# Altium schematic sheet GPIO_EXPANDER_Sheet.SchDoc
size 420 x 297 mm; SheetNumber: 6; SheetTotal: 14
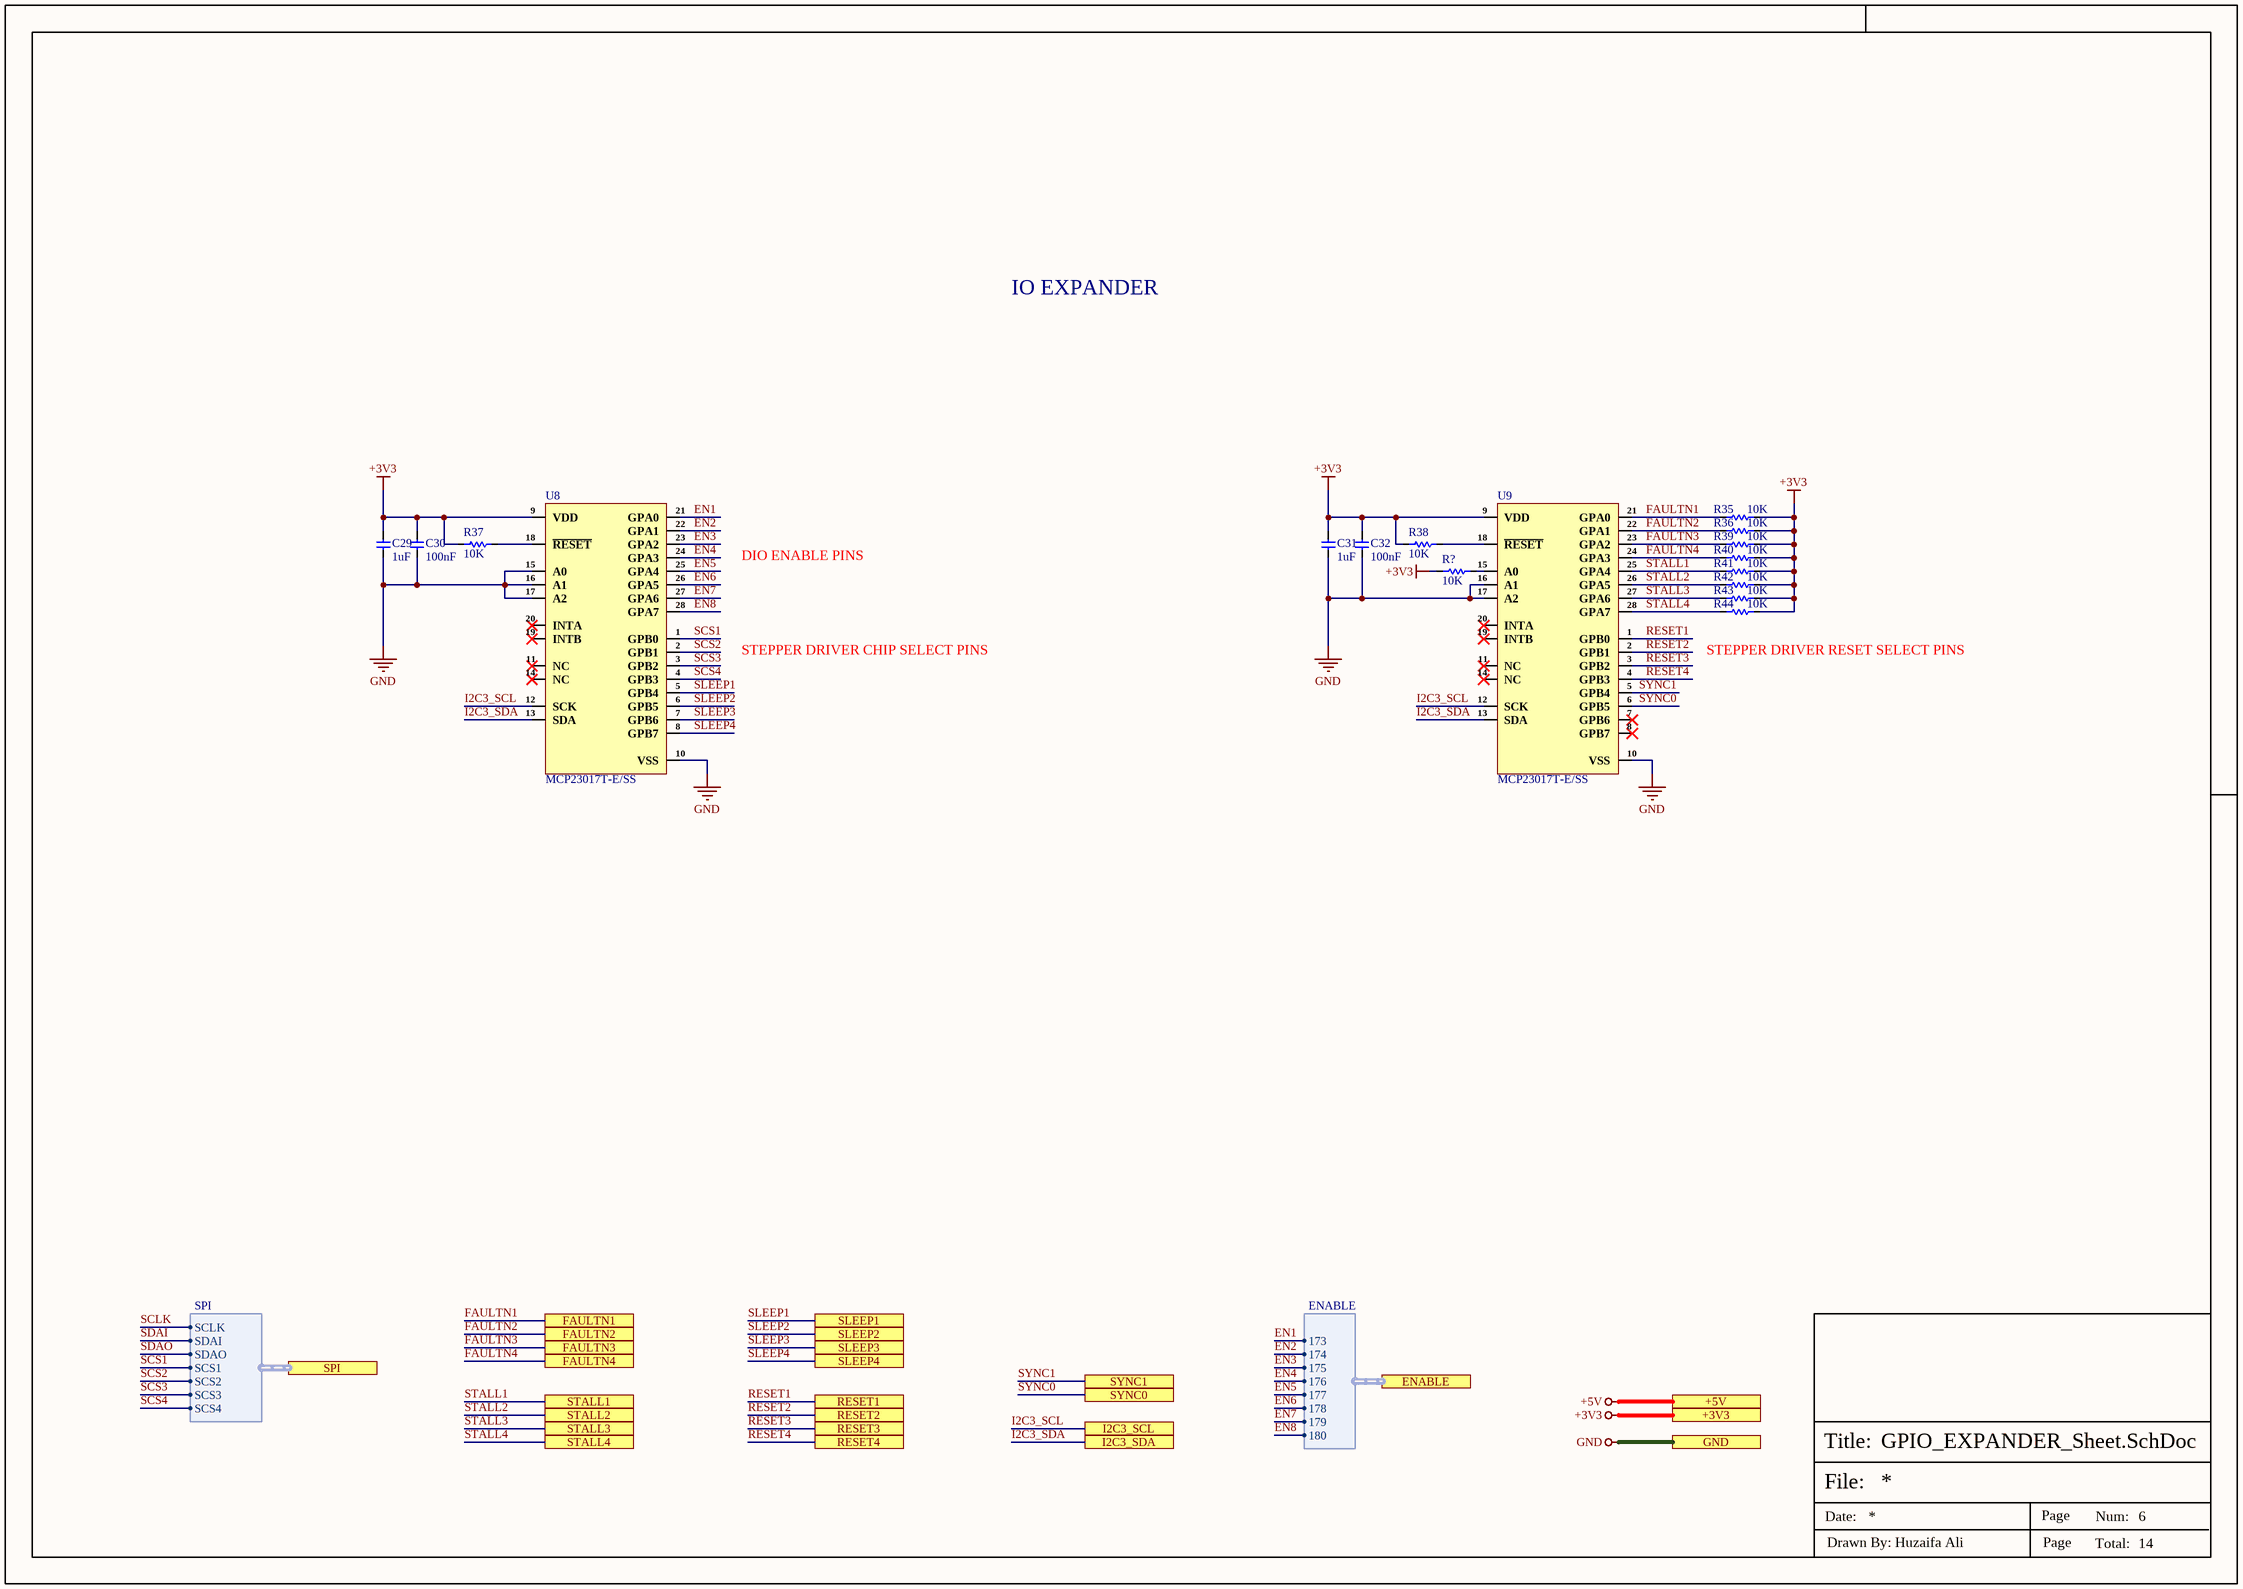
[diagram p0: GPIO_EXPANDER_Sheet.SchDoc]

## Parts
C29  1uF  [Cap-0402]
C30  100nF  [cap-0402]
C31  1uF  [Cap-0402]
C32  100nF  [cap-0402]
R35  10K  [Res-0402]
R36  10K  [Res-0402]
R37  10K  [Res-0402]
R38  10K  [Res-0402]
R39  10K  [Res-0402]
R40  10K  [Res-0402]
R41  10K  [Res-0402]
R42  10K  [Res-0402]
R43  10K  [Res-0402]
R44  10K  [Res-0402]
R?  10K  [Res-0402]
U8  MCP23017T-E/SS  [SSOP-28-208mil]
U9  MCP23017T-E/SS  [SSOP-28-208mil]

## Ports
+3V3 (see Top_Sheet[4C], CAN_Sheet[5D], Controller_Sheet[5D], EtherCAT_Sheet[5D], Power_Sheet[5D], RJ45_Sheet[5D], RS485_RS232_Sheet[2D], Stepper_Driver_Sheet1[5D], Stepper_Driver_Sheet2[5D], Stepper_Driver_Sheet3[5D], Stepper_Driver_Sheet4[5D]), +5V (see Top_Sheet[4C], CAN_Sheet[5D], DIO_Isolation_Sheet[5D], Power_Sheet[5D]), ENABLE (harness ENABLE, see Top_Sheet[4D], DIO_Isolation_Sheet[6A]), FAULTN1 (see Top_Sheet[4C], Stepper_Driver_Sheet1[3D]), FAULTN2 (see Top_Sheet[4C], Stepper_Driver_Sheet2[3D]), FAULTN3 (see Top_Sheet[4C], Stepper_Driver_Sheet3[3D]), FAULTN4 (see Top_Sheet[4C], Stepper_Driver_Sheet4[3D]), GND (see Top_Sheet[4C], CAN_Sheet[5D], Connector_Sheet[5D], Controller_Sheet[5D], DIO_Isolation_Sheet[5D], EtherCAT_Sheet[5D], Power_Sheet[5D], RJ45_Sheet[5D], RS485_RS232_Sheet[2D], Stepper_Driver_Sheet1[5D], Stepper_Driver_Sheet2[5D], Stepper_Driver_Sheet3[5D], Stepper_Driver_Sheet4[5D]), I2C3_SCL (see Top_Sheet[5C], Controller_Sheet[5D]), I2C3_SDA (see Top_Sheet[5C], Controller_Sheet[5D]), RESET1 (see Top_Sheet[4D], Stepper_Driver_Sheet1[4D]), RESET2 (see Top_Sheet[4D], Stepper_Driver_Sheet2[4D]), RESET3 (see Top_Sheet[4D], Stepper_Driver_Sheet3[4D]), RESET4 (see Top_Sheet[4D], Stepper_Driver_Sheet4[4D]), SLEEP1 (see Top_Sheet[4D], Stepper_Driver_Sheet1[4D]), SLEEP2 (see Top_Sheet[4D], Stepper_Driver_Sheet2[4D]), SLEEP3 (see Top_Sheet[4D], Stepper_Driver_Sheet3[4D]), SLEEP4 (see Top_Sheet[4D], Stepper_Driver_Sheet4[4D]), SPI (harness SPI, see Top_Sheet[5C], Controller_Sheet[1D], Stepper_Driver_Sheet1[1D], Stepper_Driver_Sheet2[1D], Stepper_Driver_Sheet3[1D], Stepper_Driver_Sheet4[1D]), STALL1 (see Top_Sheet[4C], Stepper_Driver_Sheet1[3D]), STALL2 (see Top_Sheet[4C], Stepper_Driver_Sheet2[3D]), STALL3 (see Top_Sheet[4C], Stepper_Driver_Sheet3[3D]), STALL4 (see Top_Sheet[4D], Stepper_Driver_Sheet4[3D]), SYNC0 (see Top_Sheet[5C], EtherCAT_Sheet[1D]), SYNC1 (see Top_Sheet[5C], EtherCAT_Sheet[1D])

## Harnesses
ENABLE: 173, 174, 175, 176, 177, 178, 179, 180
SPI: SCLK, SDAI, SDAO, SCS1, SCS2, SCS3, SCS4

## Nets
+3V3: C29.2 C30.2 C31.2 C32.2 R35.1 R36.1 R37.2 R38.2 R39.1 R40.1 R41.1 R42.1 R43.1 R44.1 R?.2 U8.9(VDD) U9.9(VDD) ; port +3V3
+5V: port +5V
GND: C29.1 C30.1 C31.1 C32.1 U8.10(VSS) U8.15(A0) U8.16(A1) U8.17(A2) U9.10(VSS) U9.16(A1) U9.17(A2) ; port GND
EN1: U8.21(GPA0) ; port ENABLE.173
EN2: U8.22(GPA1) ; port ENABLE.174
EN3: U8.23(GPA2) ; port ENABLE.175
EN4: U8.24(GPA3) ; port ENABLE.176
EN5: U8.25(GPA4) ; port ENABLE.177
EN6: U8.26(GPA5) ; port ENABLE.178
EN7: U8.27(GPA6) ; port ENABLE.179
EN8: U8.28(GPA7) ; port ENABLE.180
FAULTN1: R35.2 U9.21(GPA0) ; port FAULTN1
FAULTN2: R36.2 U9.22(GPA1) ; port FAULTN2
FAULTN3: R39.2 U9.23(GPA2) ; port FAULTN3
FAULTN4: R40.2 U9.24(GPA3) ; port FAULTN4
I2C3_SCL: U8.12(SCK) U9.12(SCK) ; port I2C3_SCL
I2C3_SDA: U8.13(SDA) U9.13(SDA) ; port I2C3_SDA
RESET1: U9.1(GPB0) ; port RESET1
RESET2: U9.2(GPB1) ; port RESET2
RESET3: U9.3(GPB2) ; port RESET3
RESET4: U9.4(GPB3) ; port RESET4
SCLK: port SPI.SCLK
SCS1: U8.1(GPB0) ; port SPI.SCS1
SCS2: U8.2(GPB1) ; port SPI.SCS2
SCS3: U8.3(GPB2) ; port SPI.SCS3
SCS4: U8.4(GPB3) ; port SPI.SCS4
SDAI: port SPI.SDAI
SDAO: port SPI.SDAO
SLEEP1: U8.5(GPB4) ; port SLEEP1
SLEEP2: U8.6(GPB5) ; port SLEEP2
SLEEP3: U8.7(GPB6) ; port SLEEP3
SLEEP4: U8.8(GPB7) ; port SLEEP4
STALL1: R41.2 U9.25(GPA4) ; port STALL1
STALL2: R42.2 U9.26(GPA5) ; port STALL2
STALL3: R43.2 U9.27(GPA6) ; port STALL3
STALL4: R44.2 U9.28(GPA7) ; port STALL4
SYNC0: U9.6(GPB5) ; port SYNC0
SYNC1: U9.5(GPB4) ; port SYNC1
NetR37_1: R37.1 U8.18(~{RESET})
NetR38_1: R38.1 U9.18(~{RESET})
NetR?_1: R?.1 U9.15(A0)

Not connected (* = marked no-connect by the designer): U8 11(NC)* 14(NC)* 19(INTB)* 20(INTA)*; U9 7(GPB6)* 8(GPB7)* 11(NC)* 14(NC)* 19(INTB)* 20(INTA)*

## Notes on the sheet
- IO EXPANDER
- DIO ENABLE PINS
- STEPPER DRIVER CHIP SELECT PINS
- STEPPER DRIVER RESET SELECT PINS
- File:
- Title:
- Date:
- Page
- Num:
- Total:
- Drawn By: Huzaifa Ali

## Library data of the parts
C29 C31 = CC0402KRX5R6BB105: CAP CER 1UF 10V X5R 0402; Manufacturer: Yageo; Tolerance: 10%; Dissipation Factor: 15%; Item Type: Capacitor; Supplier 1: Mouser; Manufacturer Part Number: CC0402KRX5R6BB105; RoHS: Yes; Category: Ceramic Capacitors; Stock 1: 6711367; Pricing 1: 1=0.11000, 10=0.05500, 50=0.05500, 100=0.03300, 500=0.02700, 1000=0.02200, 2500=0.02100, 10000=0.01800 (USD); Mount: Surface Mount; Case/Package: 0402; Number of Pins: 2; Case Code (Metric): 1005; Case Code (Imperial): 0402; Min Operating Temperature: -55°C; Max Operating Temperature: 85°C; Capacitance: 1uF; Dielectric: X5R; Package Quantity: 1; Voltage Rating: 10V; Packaging: Tape and Reel; Voltage Rating (DC): 10V; Termination: SMD/SMT; Resistor Type: Ceramic; Series: CC; Construction: Flat; Length: 1mm; Width: 0.02inch; Height: 0.5mm; Thickness: 0.022inch; Depth: 0.5mm; Radiation Hardening: No; REACH SVHC: No SVHC; Lead Free: Lead Free; Halogen Free: Halogen Free; RoHS Compliant: Yes; ComponentLink1URL: https://datasheet.ciiva.com/176/upy-gphc-x5r-4v-to-50v-12-176704.pdf?src-supplier=Digi-Key; ComponentLink1Description: https://datasheet.ciiva.com/176/upy-gphc-x5r-4v-to-50v-12-176704.pdf?src-supplier=Digi-Key; ComponentLink2URL: https://datasheet.ciiva.com/176/mlccorderingcode-176705.pdf?src-supplier=Digi-Key; ComponentLink2Description: https://datasheet.ciiva.com/176/mlccorderingcode-176705.pdf?src-supplier=Digi-Key; ComponentLink3URL: https://datasheet.ciiva.com/176/mlccorderingcode-176706.pdf?src-supplier=Digi-Key; ComponentLink3Description: https://datasheet.ciiva.com/176/mlccorderingcode-176706.pdf?src-supplier=Digi-Key; Supplier Part Number 1: 603-CC402KRX5R6BB105; LCSC Part Number: C106254
C30 C32 = C1005X7R1H104KT000F: CAP CER 0.1UF 50V X7R 0402; Manufacturer: TDK; Tolerance: 10%; Voltage: 25V; Item Type: Capacitor; Supplier 1: Avnet; Manufacturer Part Number: C1005X7R1H104KT000F; RoHS: No; Category: Ceramic Capacitors; Dielectric: X7R; Supplier Part Number 1: C1005X7R1H104KT000F; LCSC Part Number: C361198; ComponentLink1Description: LCSC; ComponentLink1URL: https://www.lcsc.com/product-detail/Multilayer-Ceramic-Capacitors-MLCC-SMD-SMT_TDK-C1005X7R1H104KT000F_C361198.html
R35-R44 R? = RC0402FR-0710KL: RES 10K OHM 1% 1/16W 0402; Manufacturer: Yageo; Resistance: 10kR; Voltage Rating (DC): 50V; Temperature Coefficient: 100ppm/°C; Power Rating: 62.5mW; Max Power Dissipation: 63mW; Item Type: Resistor; Supplier 1: Mouser; Manufacturer Part Number: RC0402FR-0710KL; RoHS: Yes; Category: Chip SMD Resistors; Stock 1: 18648329; Pricing 1: 1=0.10000, 10=0.01400, 50=0.01400, 100=0.00500, 1000=0.00300, 10000=0.00200 (USD); Case/Package: 0402; Number of Pins: 2; Case Code (Imperial): 0402; Case Code (Metric): 1005; Min Operating Temperature: -55°C; Max Operating Temperature: 155°C; Resistor Type: Thick Film; Tolerance: 1%; Packaging: Tape and Reel; Voltage Rating: 50V; Termination: SMD/SMT; Working Voltage: 50V; Number of Terminations: 2; Features: Moisture Resistant; Series: RC; Resistance Tolerance: 1%; Construction: Rectangular; Length: 1mm; Width: 0.5mm; Height: 0.32mm; Depth: 0.5mm; Lead Pitch: 0.2mm; REACH SVHC: No SVHC; Lead Free: Lead Free; RoHS Compliant: Yes; Military Standard: Not; ComponentLink1URL: https://datasheet.ciiva.com/7660/38568-7660787.pdf?src-supplier=Element14; ComponentLink1Description: https://datasheet.ciiva.com/7660/38568-7660787.pdf?src-supplier=Element14; ComponentLink2URL: https://datasheet.ciiva.com/7849/1686128-7849814.pdf?src-supplier=Element14; ComponentLink2Description: https://datasheet.ciiva.com/7849/1686128-7849814.pdf?src-supplier=Element14; ComponentLink3URL: https://datasheet.ciiva.com/7983/1018594-7983486.pdf?src-supplier=Element14; ComponentLink3Description: https://datasheet.ciiva.com/7983/1018594-7983486.pdf?src-supplier=Element14; ComponentLink4URL: https://datasheet.ciiva.com/22747/1018594-22747512.pdf?src-supplier=Element14; ComponentLink4Description: https://datasheet.ciiva.com/22747/1018594-22747512.pdf?src-supplier=Element14; ComponentLink5URL: https://datasheet.ciiva.com/12667/pyu-rc0402-51-rohs-l-6-r-12667067.pdf?src-supplier=Mouser; ComponentLink5Description: https://datasheet.ciiva.com/12667/pyu-rc0402-51-rohs-l-6-r-12667067.pdf?src-supplier=Mouser; ComponentLink6URL: https://datasheet.ciiva.com/7849/1784430-7849813.pdf?src-supplier=Element14; ComponentLink6Description: https://datasheet.ciiva.com/7849/1784430-7849813.pdf?src-supplier=Element14; ComponentLink7URL: https://datasheet.ciiva.com/7849/1784430-7849815.pdf?src-supplier=Element14; ComponentLink7Description: https://datasheet.ciiva.com/7849/1784430-7849815.pdf?src-supplier=Element14; Supplier Part Number 1: 603-RC0402FR-0710KL; LCSC Part Number: C60490
U8 U9 = MCP23017T-E/SS: IC XPNDR 1.7MHZ I2C 28SSOP; Manufacturer: Microchip; Operating Supply Voltage: 5.5V; Interface: I2C,Serial; Number of Channels: 1; Output Current: 25mA; Number of I/Os: 16; Power Dissipation: 700mW; Clock Frequency: 10MHz; Output Type: PUSH-PULL; Supply Current: 1mA; Supplier 1: Digi-Key; Manufacturer Part Number: MCP23017T-E/SS; RoHS: Yes; Category: Interface ICs; Stock 1: 26314; Pricing 1: 1=1.69, 25=1.4, 100=1.28 (USD); Mounting Technology: Surface Mount; Case/Package: SSOP; Pins: 28; Min Operating Temperature: -40°C; Max Operating Temperature: 125°C; Package Quantity: 2100; Series: -; Packaging: Tape and Reel; Frequency: 1.7MHz; Number of Bits: 16; Nominal Supply Voltage: 5.5V; Lead Free: Lead Free; RoHS Compliant: Yes; ComponentLink1URL: https://datasheet.ciiva.com/12267/21952b-12267583.pdf?src-supplier=Mouser; ComponentLink1Description: https://datasheet.ciiva.com/12267/21952b-12267583.pdf?src-supplier=Mouser; ComponentLink2URL: https://datasheet.ciiva.com/8128/21952b-8128586.pdf?src-supplier=Avnet; ComponentLink2Description: https://datasheet.ciiva.com/8128/21952b-8128586.pdf?src-supplier=Avnet; ComponentLink3URL: https://datasheet.ciiva.com/16454/filehandler-aspxddocname-en023709-16454267.pdf?src-supplier=Future+Electronics; ComponentLink3Description: https://datasheet.ciiva.com/16454/filehandler-aspxddocname-en023709-16454267.pdf?src-supplier=Future+Electronics; ComponentLink4URL: https://datasheet.ciiva.com/1780/21952b-1780738.pdf?src-supplier=Digi-Key; ComponentLink4Description: https://datasheet.ciiva.com/1780/21952b-1780738.pdf?src-supplier=Digi-Key; Supplier Part Number 1: MCP23017T-E/SSCT-ND; LCSC Part Number: C558584; Item Type: IC